# EAGLE design 131206_AriloRX_0_0 (EAGLE 6.4)
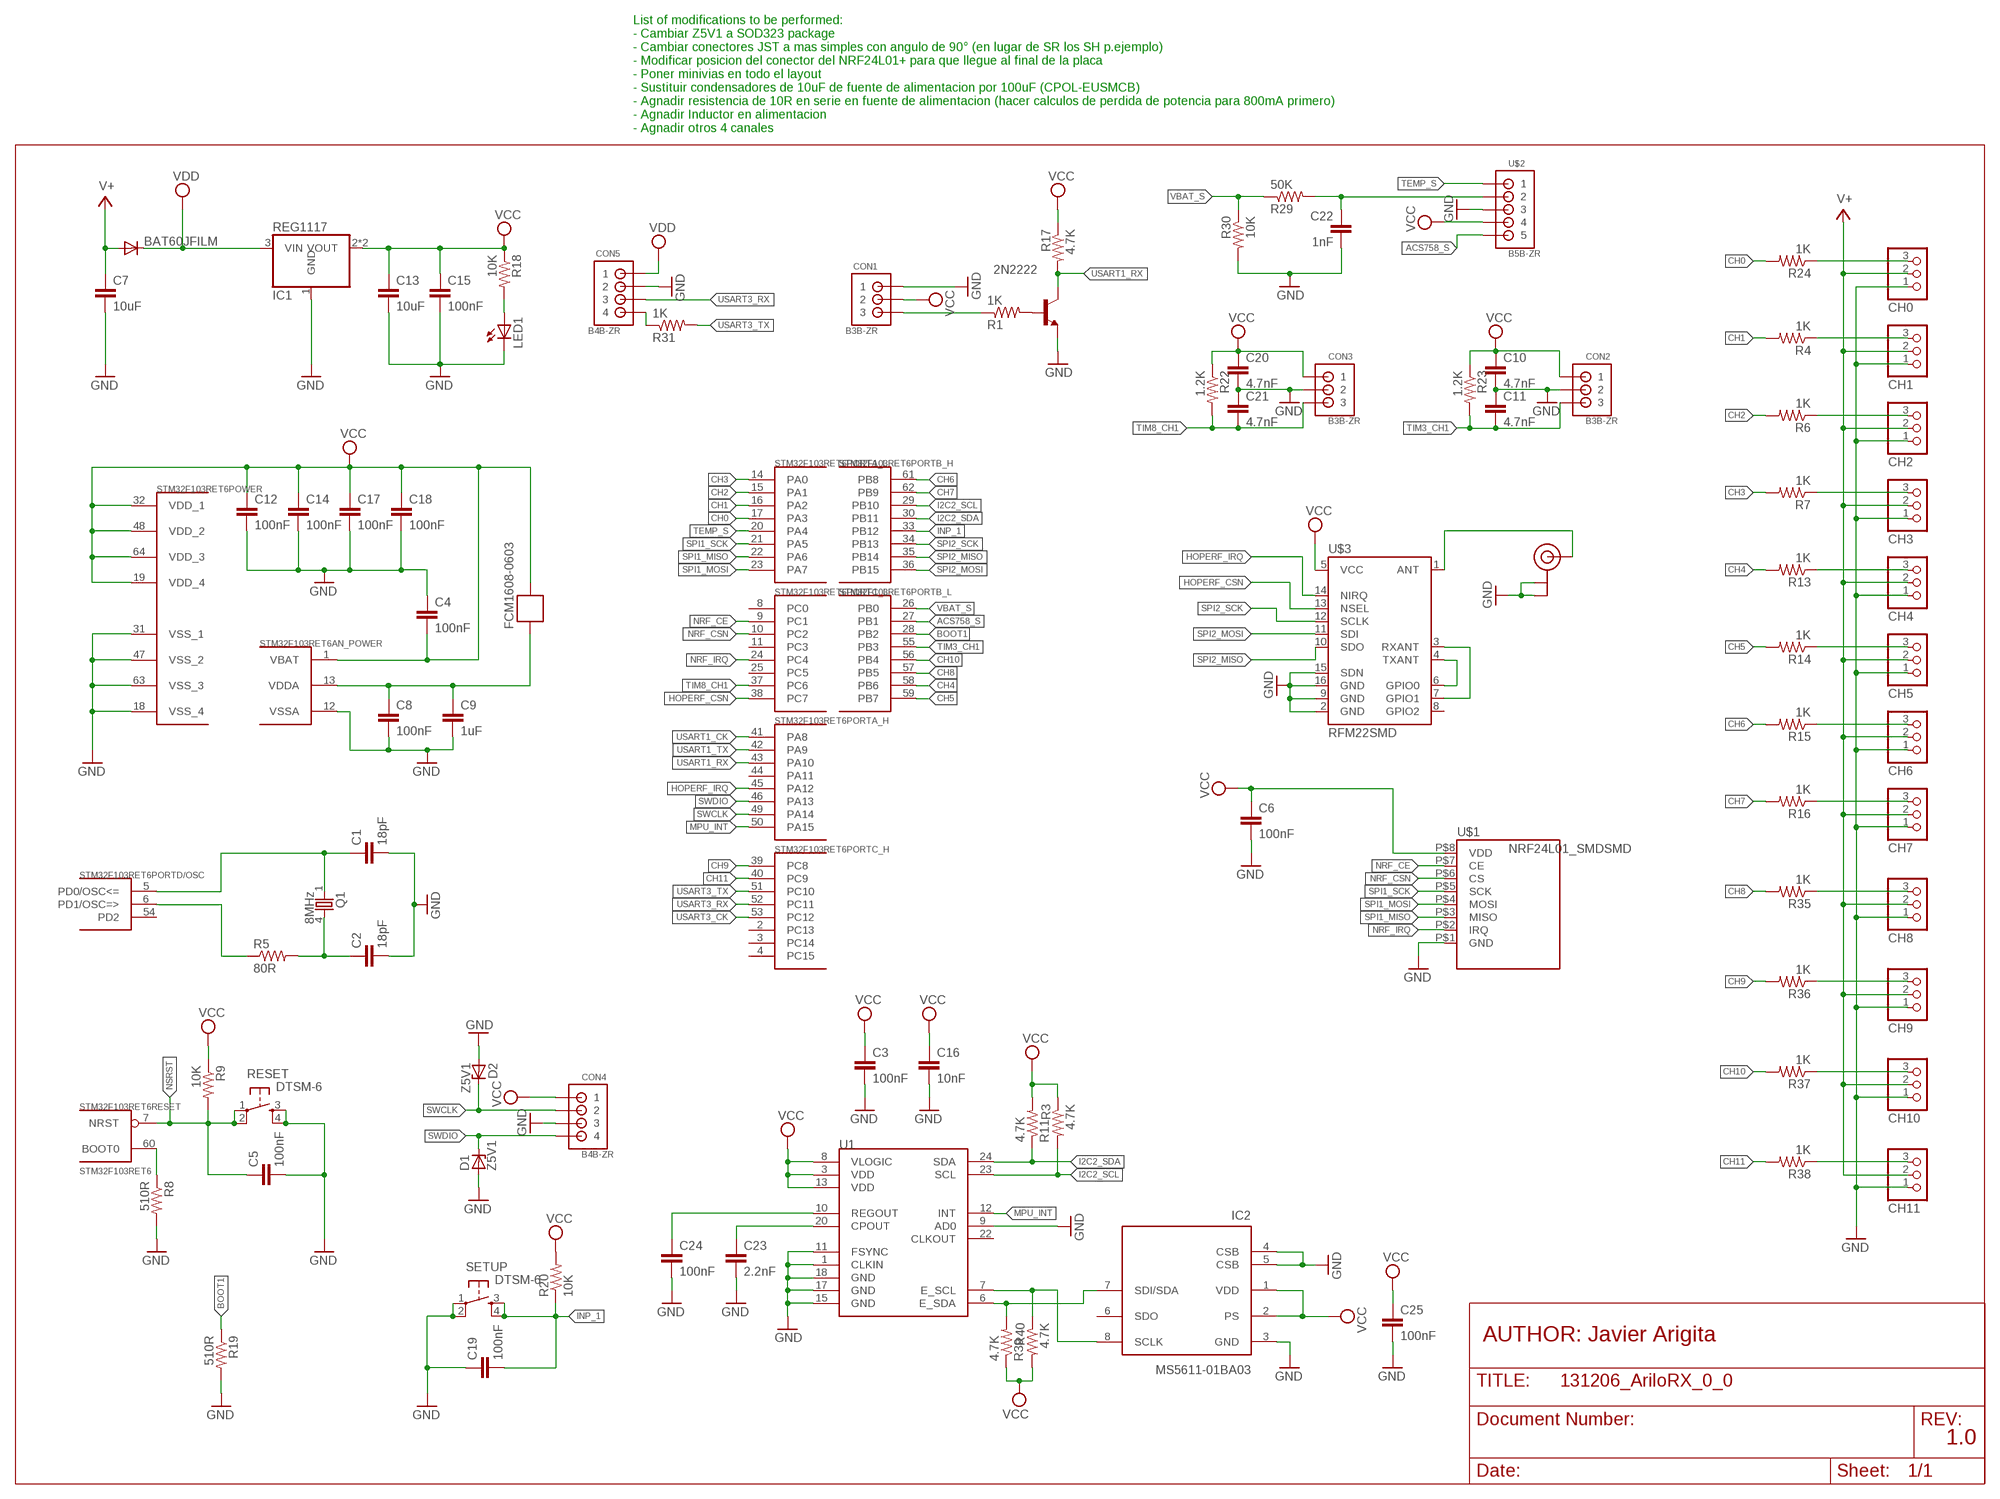
[diagram p0: schematic, sheet 1]

## Parts
2N2222  MMBT2222ALT1-NPN-SOT23-BEC  [SOT23-BEC]
BAT60JFILM  DIODE-SOD323-R  [SOD323-R]
C1  18pF  C-EUC0805  [C0805]
C2  18pF  C-EUC0805  [C0805]
C3  100nF  C-EUC0805  [C0805]
C4  100nF  C-EUC0805  [C0805]
C5  100nF  C-EUC0805  [C0805]
C6  100nF  C-EUC0805  [C0805]
C7  10uF  C-EUC3216  [C3216]
C8  100nF  C-EUC0805  [C0805]
C9  1uF  C-EUC3216  [C3216]
C10  4.7nF  C-EUC0805  [C0805]
C11  4.7nF  C-EUC0805  [C0805]
C12  100nF  C-EUC0805  [C0805]
C13  10uF  C-EUC3216  [C3216]
C14  100nF  C-EUC0805  [C0805]
C15  100nF  C-EUC0805  [C0805]
C16  10nF  C-EUC0805  [C0805]
C17  100nF  C-EUC0805  [C0805]
C18  100nF  C-EUC0805  [C0805]
C19  100nF  C-EUC0805  [C0805]
C20  4.7nF  C-EUC0805  [C0805]
C21  4.7nF  C-EUC0805  [C0805]
C22  1nF  C-EUC0805  [C0805]
C23  2.2nF  C-EUC0805  [C0805]
C24  100nF  C-EUC0805  [C0805]
C25  100nF  C-EUC0805  [C0805]
CH0  PINHD-1X3  [1X03]
CH1  PINHD-1X3  [1X03]
CH2  PINHD-1X3  [1X03]
CH3  PINHD-1X3  [1X03]
CH4  PINHD-1X3  [1X03]
CH5  PINHD-1X3  [1X03]
CH6  PINHD-1X3  [1X03]
CH7  PINHD-1X3  [1X03]
CH8  PINHD-1X3  [1X03]
CH9  PINHD-1X3  [1X03]
CH10  PINHD-1X3  [1X03]
CH11  PINHD-1X3  [1X03]
CON1  B3B-ZR  [B3B-ZR]
CON2  B3B-ZR  [B3B-ZR]
CON3  B3B-ZR  [B3B-ZR]
CON4  B4B-ZR  [B4B-ZR]
CON5  B4B-ZR  [B4B-ZR]
D1  Z5V1  ZENER-DIODESOD80C  [SOD80C]
D2  Z5V1  ZENER-DIODESOD80C  [SOD80C]
FCM1608-0603  FERRITE-BEAD  [R0603]
IC1  REG1117  [SOT223]
IC2  MS5611-01BA03  [SON125P300X500X100-8N]
LED1  LED0805  [CHIPLED_0805]
Q1  8MHz  MA506  [MA506]
R1  1K  RESISTOR0805  [R0805]
R3  4.7K  RESISTOR0805  [R0805]
R4  1K  RESISTOR0805  [R0805]
R5  80R  RESISTOR0805  [R0805]
R6  1K  RESISTOR0805  [R0805]
R7  1K  RESISTOR0805  [R0805]
R8  510R  RESISTOR0805  [R0805]
R9  10K  RESISTOR0805  [R0805]
R11  4.7K  RESISTOR0805  [R0805]
R13  1K  RESISTOR0805  [R0805]
R14  1K  RESISTOR0805  [R0805]
R15  1K  RESISTOR0805  [R0805]
R16  1K  RESISTOR0805  [R0805]
R17  4.7K  RESISTOR0805  [R0805]
R18  10K  RESISTOR0805  [R0805]
R19  510R  RESISTOR0805  [R0805]
R20  10K  RESISTOR0805  [R0805]
R22  1.2K  RESISTOR0805  [R0805]
R23  1.2K  RESISTOR0805  [R0805]
R24  1K  RESISTOR0805  [R0805]
R29  50K  RESISTOR0805  [R0805]
R30  10K  RESISTOR0805  [R0805]
R31  1K  RESISTOR0805  [R0805]
R35  1K  RESISTOR0805  [R0805]
R36  1K  RESISTOR0805  [R0805]
R37  1K  RESISTOR0805  [R0805]
R38  1K  RESISTOR0805  [R0805]
R39  4.7K  RESISTOR0805  [R0805]
R40  4.7K  RESISTOR0805  [R0805]
RESET  DTSM-6  [DTSM-6]
SETUP  DTSM-6  [DTSM-6]
STM32F103RET6  STM32F103RET6  STM32F10XRXT6  [TQFP64]
U1  MPU-9150QFN-24-NP  [QFN-24-NP]
U$1  NRF24L01_SMDSMD  [NRF24L01_SMD]
U$2  B5B-ZR  [B5B-ZR]
U$3  RFM22SMD  [RFM22-XXX-S2]
U$4  U.FL  [U.FL]

## Nets
ACS758_S: STM32F103RET6.27(PORTB_L:PB1) U$2.5
BOOT1: R19.1 STM32F103RET6.28(PORTB_L:PB2)
CH0: R24.2 STM32F103RET6.17(PORTA_L:PA3)
CH1: R4.2 STM32F103RET6.16(PORTA_L:PA2)
CH2: R6.2 STM32F103RET6.15(PORTA_L:PA1)
CH3: R7.2 STM32F103RET6.14(PORTA_L:PA0)
CH4: R13.2 STM32F103RET6.58(PORTB_L:PB6)
CH5: R14.2 STM32F103RET6.59(PORTB_L:PB7)
CH6: R15.2 STM32F103RET6.61(PORTB_H:PB8)
CH7: R16.2 STM32F103RET6.62(PORTB_H:PB9)
CH8: R35.2 STM32F103RET6.57(PORTB_L:PB5)
CH9: R36.2 STM32F103RET6.39(PORTC_H:PC8)
CH10: R37.2 STM32F103RET6.56(PORTB_L:PB4)
CH11: R38.2 STM32F103RET6.40(PORTC_H:PC9)
GND: 2N2222.E C1.2 C2.2 C3.2 C4.1 C5.2 C6.2 C7.2 C8.2 C9.2 C10.2 C11.1 C12.2 C13.2 C14.2 C15.2 C16.2 C17.2 C18.2 C19.1 C20.2 C21.1 C22.2 C23.2 C24.2 C25.2 CH0.1 CH1.1 CH2.1 CH3.1 CH4.1 CH5.1 CH6.1 CH7.1 CH8.1 CH9.1 CH10.1 CH11.1 CON1.1 CON2.2 CON3.2 CON4.3 CON5.2 D1.A D2.A IC1.1(GND) IC2.3(GND) IC2.4(CSB) IC2.5(CSB) LED1.C R8.2 R19.2 R30.2 RESET.3 RESET.4 SETUP.1 SETUP.2 STM32F103RET6.12(AN_POWER:VSSA) STM32F103RET6.18(POWER:VSS_4) STM32F103RET6.31(POWER:VSS_1) STM32F103RET6.47(POWER:VSS_2) STM32F103RET6.63(POWER:VSS_3) U1.1(CLKIN) U1.9(AD0) U1.11(FSYNC) U1.15(GND) U1.17(GND) U1.18(GND) U$1.P$1(GND) U$2.3 U$3.2(GND) U$3.9(GND) U$3.15(SDN) U$3.16(GND) U$4.P$1(GND) U$4.P$2(GND)
HOPERF_CSN: STM32F103RET6.38(PORTC_L:PC7) U$3.13(NSEL)
HOPERF_IRQ: STM32F103RET6.45(PORTA_H:PA12) U$3.14(NIRQ)
I2C2_SCL: R3.2 STM32F103RET6.29(PORTB_H:PB10) U1.23(SCL)
I2C2_SDA: R11.1 STM32F103RET6.30(PORTB_H:PB11) U1.24(SDA)
INP_1: C19.2 R20.1 SETUP.3 SETUP.4 STM32F103RET6.33(PORTB_H:PB12)
MPU_INT: STM32F103RET6.50(PORTA_H:PA15) U1.12(INT)
N$1: C1.1 Q1.1 STM32F103RET6.5(PORTD/OSC:PD0/OSC<=)
N$2: R5.1 STM32F103RET6.6(PORTD/OSC:PD1/OSC=>)
N$3: C2.1 Q1.4 R5.2
N$4: R8.1 STM32F103RET6.60(RESET:BOOT0)
N$5: U$3.3(RXANT) U$3.7(GPIO1)
N$6: U$3.4(TXANT) U$3.6(GPIO0)
N$7: U$3.1(ANT) U$4.P$3(SIGNAL)
N$9: CH0.3 R24.1
N$10: LED1.A R18.2
N$11: CON5.4 R31.1
N$13: CH8.3 R35.1
N$14: CON1.3 R1.1
N$15: C22.1 R29.2 U$2.2
N$16: 2N2222.B R1.2
N$17: C8.1 C9.1 FCM1608-0603.2 STM32F103RET6.13(AN_POWER:VDDA)
N$21: CH2.3 R6.1
N$23: CH4.3 R13.1
N$25: CH9.3 R36.1
N$26: CH10.3 R37.1
N$27: CH11.3 R38.1
N$28: IC2.8(SCLK) R40.1 U1.7(E_SCL)
N$29: IC2.7(SDI/SDA) R39.2 U1.6(E_SDA)
N$31: CH3.3 R7.1
N$32: CH6.3 R15.1
N$33: C23.1 U1.20(CPOUT)
N$34: CH5.3 R14.1
N$35: CH7.3 R16.1
N$40: C24.1 U1.10(REGOUT)
N$53: CH1.3 R4.1
NRF_CE: STM32F103RET6.9(PORTC_L:PC1) U$1.P$7(CE)
NRF_CSN: STM32F103RET6.10(PORTC_L:PC2) U$1.P$6(CS)
NRF_IRQ: STM32F103RET6.24(PORTC_L:PC4) U$1.P$2(IRQ)
NSRST: C5.1 R9.2 RESET.1 RESET.2 STM32F103RET6.7(RESET:NRST)
SPI1_MISO: STM32F103RET6.22(PORTA_L:PA6) U$1.P$3(MISO)
SPI1_MOSI: STM32F103RET6.23(PORTA_L:PA7) U$1.P$4(MOSI)
SPI1_SCK: STM32F103RET6.21(PORTA_L:PA5) U$1.P$5(SCK)
SPI2_MISO: STM32F103RET6.35(PORTB_H:PB14) U$3.10(SDO)
SPI2_MOSI: STM32F103RET6.36(PORTB_H:PB15) U$3.11(SDI)
SPI2_SCK: STM32F103RET6.34(PORTB_H:PB13) U$3.12(SCLK)
SWCLK: CON4.2 D2.C STM32F103RET6.49(PORTA_H:PA14)
SWDIO: CON4.4 D1.C STM32F103RET6.46(PORTA_H:PA13)
TEMP_S: STM32F103RET6.20(PORTA_L:PA4) U$2.1
TIM3_CH1: C11.2 CON2.3 R23.2 STM32F103RET6.55(PORTB_L:PB3)
TIM8_CH1: C21.2 CON3.3 R22.2 STM32F103RET6.37(PORTC_L:PC6)
USART1_CK: STM32F103RET6.41(PORTA_H:PA8)
USART1_RX: 2N2222.C R17.2 STM32F103RET6.43(PORTA_H:PA10)
USART1_TX: STM32F103RET6.42(PORTA_H:PA9)
USART3_CK: STM32F103RET6.53(PORTC_H:PC12)
USART3_RX: CON5.3 STM32F103RET6.52(PORTC_H:PC11)
USART3_TX: R31.2 STM32F103RET6.51(PORTC_H:PC10)
V+: BAT60JFILM.A C7.1 CH0.2 CH1.2 CH2.2 CH3.2 CH4.2 CH5.2 CH6.2 CH7.2 CH8.2 CH9.2 CH10.2 CH11.2
VBAT_S: R29.1 R30.1 STM32F103RET6.26(PORTB_L:PB0)
VCC: C3.1 C4.2 C6.1 C10.1 C12.1 C13.1 C14.1 C15.1 C16.1 C17.1 C18.1 C20.1 C25.1 CON1.2 CON2.1 CON3.1 CON4.1 FCM1608-0603.1 IC1.2(VOUT) IC1.4(VOUT) IC2.1(VDD) IC2.2(PS) R3.1 R9.1 R11.2 R17.1 R18.1 R20.2 R22.1 R23.1 R39.1 R40.2 STM32F103RET6.1(AN_POWER:VBAT) STM32F103RET6.19(POWER:VDD_4) STM32F103RET6.32(POWER:VDD_1) STM32F103RET6.48(POWER:VDD_2) STM32F103RET6.64(POWER:VDD_3) U1.3(VDD) U1.8(VLOGIC) U1.13(VDD) U$1.P$8(VDD) U$2.4 U$3.5(VCC)
VDD: BAT60JFILM.C CON5.1 IC1.3(VIN)
Unconnected: IC2.6(SDO) STM32F103RET6.2(PORTC_H:PC13) STM32F103RET6.3(PORTC_H:PC14) STM32F103RET6.4(PORTC_H:PC15) STM32F103RET6.8(PORTC_L:PC0) STM32F103RET6.11(PORTC_L:PC3) STM32F103RET6.25(PORTC_L:PC5) STM32F103RET6.44(PORTA_H:PA11) STM32F103RET6.54(PORTD/OSC:PD2) U1.22(CLKOUT) U$3.8(GPIO2)

## Notes on the sheet
- List of modifications to be performed:
  - Cambiar Z5V1 a SOD323 package
  - Cambiar conectores JST a mas simples con angulo de 90° (en lugar de SR los SH p.ejemplo)
  - Modificar posicion del conector del NRF24L01+ para que llegue al final de la placa
  - Poner minivias en todo el layout
  - Sustituir condensadores de 10uF de fuente de alimentacion por 100uF (CPOL-EUSMCB)
  - Agnadir resistencia de 10R en serie en fuente de alimentacion (hacer calculos de perdida de potencia para 800mA primero)
  - Agnadir Inductor en alimentacion
  - Agnadir otros 4 canales
- AUTHOR: Javier Arigita
- 1.0

## Library data of the parts
2N2222 = transistor:*-NPN-: NPN Transistror BF959 corrected 2008.03.06
BAT60JFILM = diode:DIODE-: DIODE
C1-C6 C8 C10-C12 C14-C25 = rcl:C-EU: CAPACITOR, European symbol
C7 C9 C13 = resistor:C-EU: CAPACITOR, European symbol
CH0 CH1-CH11 = pinhead_rc:PINHD-1X3: PIN HEADER
CON1-CON3 = jst:B3B-ZR: JST-ZH Connector 3 pol, 1.5mm pitch Package: B3B-ZR Source: http://www.jst-mfg.com/product/pdf/eng/eZH.pdf
CON4 CON5 = jst:B4B-ZR: JST-ZH Connector 4 pol, 1.5mm pitch Package: B4B-ZR Source: http://www.jst-mfg.com/product/pdf/eng/eZH.pdf
D1 D2 = diode:ZENER-DIODE: Z-Diode
FCM1608-0603 = BaseApp:FERRITE-BEAD
IC1 = CEDT:REG1117: 800mA and 1A Low Dropout (LDO) Positive Regulator 1.8V, 2.5V, 2.85V, 3.3V, 5V, and Adj
IC2 = Measurement-Specialties:MS5611-01BA03: Variometer Module, with stainless steel cap
LED1 = CEDT:LED
Q1 = crystal-epson:MA506
R1 R3-R9 R11 R13-R20 R22-R24 R29-R31 R35-R40 = CEDT:RESISTOR
RESET SETUP = switch-tact:DTSM-6
STM32F103RET6 = stm32:STM32F10XRXT6: STM32F101/103 64pin LQFP
U1 = SparkFun-Sensors:MPU-9150: 9DOF (3mag, 3accel, 3rotat). I2C interface.
U$1 = NRF24L01+:NRF24L01_SMD
U$2 = jst:B5B-ZR: JST-ZH Connector 5 pol, 1.5mm pitch Package: B5B-ZR Source: http://www.jst-mfg.com/product/pdf/eng/eZH.pdf
U$3 = SparkFun-RF:RFM22: The RFM22 is a low-power, low cost radio that is capable of operating in the 434MHz and 900MHz open bands. It's frequency is software defined and there are some very good libraries written for it.
U$4 = SparkFun-Connectors:U.FL: SMD antenna connector- WRL-09144

## Board
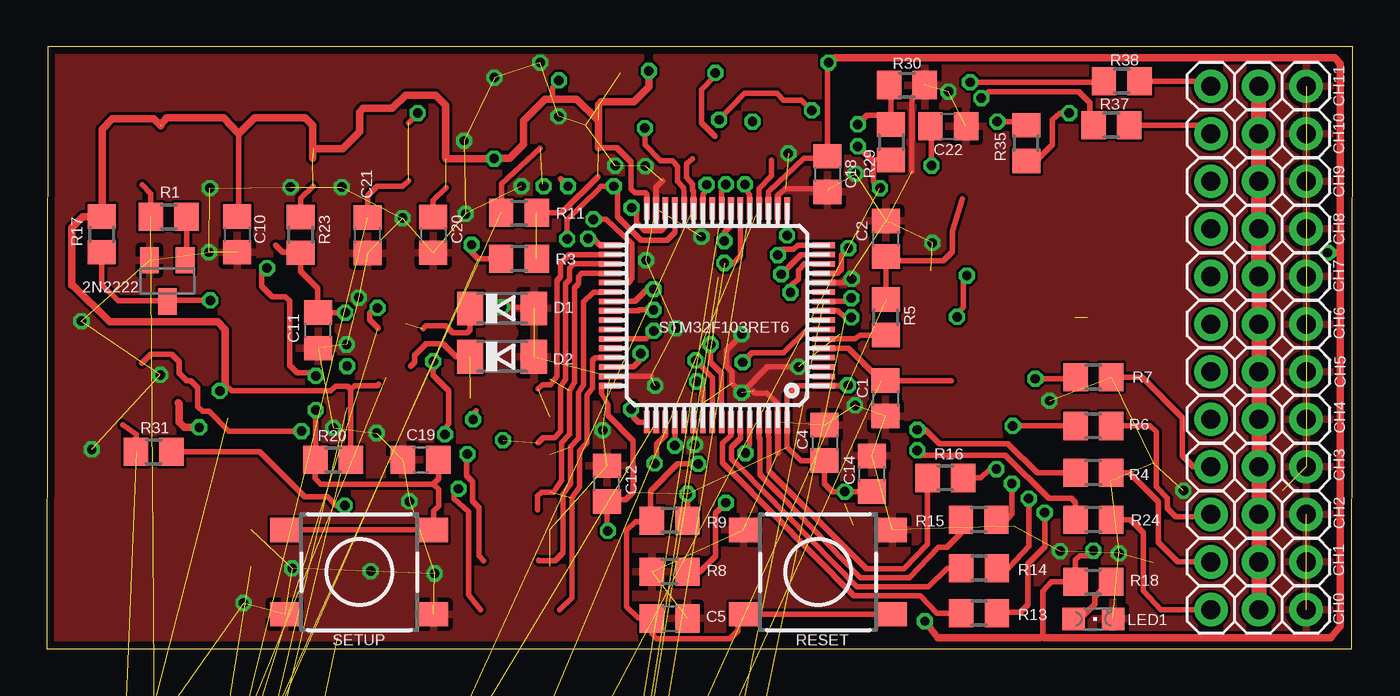
[diagram p1: board, top side]
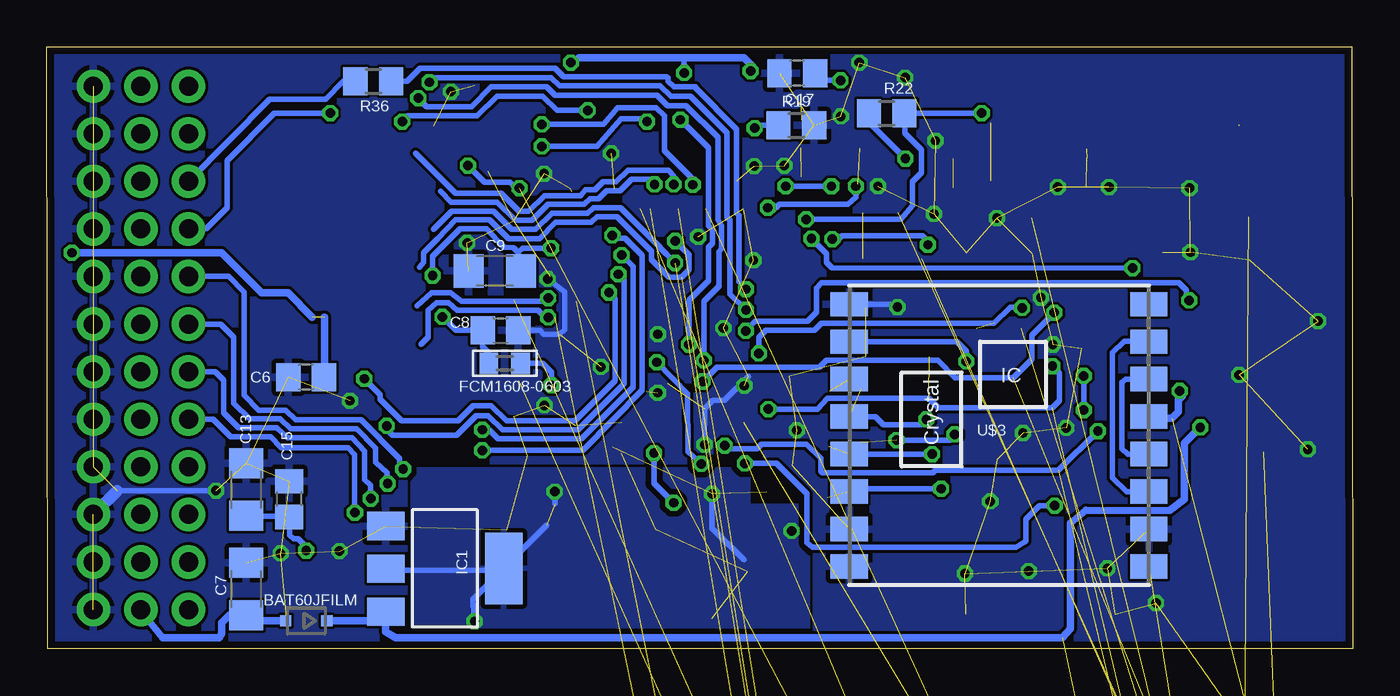
[diagram p2: board, bottom side, seen from below]

Size 69.73 x 32.14 mm. Coordinates in mm from the lower left corner, seen from the top.
Outline: 0,0 69.69,0 69.73,32.14 0.05,32.14 0,0
Copper layers (1*16): Top 0.0356mm / dielectric 1.5011mm / Bottom 0.0356mm
Design rules "default": minimum track width 6mil, minimum drill 13mil, track to track 6mil, track to pad 6mil, pad to pad 6mil, via to via 6mil, smd to smd 6mil, copper to edge 15mil, drill to drill 6mil, minimum pad ring 7mil, minimum via ring 7mil, stop-mask expansion 4mil, vias tented up to drill 0mil, thermal gap 10mil

### Footprints (pad centres in the part's own frame; a part is rotated, then mirrored left to right if it is on the bottom)
SOT23-BEC = smd 1 x 1.4: B -0.95,-1.1; C 0,1.1; E 0.95,-1.1
SOD323-R = smd 0.6 x 0.6: A 1.1,0; C -1.1,0
C0805 = smd 1.3 x 1.5: 1 -0.95,0; 2 0.95,0
C3216 = smd 1.6 x 1.8: 1 -1.4,0; 2 1.4,0
1X03 = drill 1.016 pad 1.778: 1 -2.54,0; 2 0,0; 3 2.54,0
B3B-ZR = drill 0.7 pad 1.1: 1 -1.5,0; 2 0,0; 3 1.5,0
B4B-ZR = drill 0.7: 1 6,-1.3; 2 4.5,-1.3; 3 3,-1.3; 4 1.5,-1.3
SOD80C = smd 1.4 x 1.8: A 1.7,0; C -1.7,0
R0603 = smd 1 x 1.1: 1 -0.85,0; 2 0.85,0
SOT223 = smd 1.499 x 2.007: 1 -2.261,-3.15; 2 0.025,-3.15; 3 2.311,-3.15 | smd 3.81 x 2.007: 4 0,3.15
SON125P300X500X100-8N = smd 1.35 x 0.55: 1 -1.2,1.875; 2 -1.2,0.625; 3 -1.2,-0.625; 4 -1.2,-1.875; 5 1.2,-1.875; 6 1.2,-0.625; 7 1.2,0.625; 8 1.2,1.875
CHIPLED_0805 = smd 1.2 x 1.2: A 0,-1.05; C 0,1.05
MA506 = smd 4.064 x 2.032: 1 -5.461,-1.778; 2 5.588,-1.778; 3 5.588,1.778; 4 -5.461,1.778
R0805 = smd 1.3 x 1.5: 1 -0.95,0; 2 0.95,0
DTSM-6 = smd 1.55 x 1.3: 1 -3.975,2.25; 2 3.975,2.25; 3 -3.975,-2.25; 4 3.975,-2.25
TQFP64 = smd 1.2 x 0.3: 1 -5.7,3.75; 2 -5.7,3.25; 3 -5.7,2.75; 4 -5.7,2.25; 5 -5.7,1.75; 6 -5.7,1.25; 7 -5.7,0.75; 8 -5.7,0.25; 9 -5.7,-0.25; 10 -5.7,-0.75; 11 -5.7,-1.25; 12 -5.7,-1.75; 13 -5.7,-2.25; 14 -5.7,-2.75; 15 -5.7,-3.25; 16 -5.7,-3.75; 33 5.7,-3.75; 34 5.7,-3.25; 35 5.7,-2.75; 36 5.7,-2.25; 37 5.7,-1.75; 38 5.7,-1.25; 39 5.7,-0.75; 40 5.7,-0.25; 41 5.7,0.25; 42 5.7,0.75; 43 5.7,1.25; 44 5.7,1.75; 45 5.7,2.25; 46 5.7,2.75; 47 5.7,3.25; 48 5.7,3.75 | smd 0.3 x 1.2: 17 -3.75,-5.7; 18 -3.25,-5.7; 19 -2.75,-5.7; 20 -2.25,-5.7; 21 -1.75,-5.7; 22 -1.25,-5.7; 23 -0.75,-5.7; 24 -0.25,-5.7; 25 0.25,-5.7; 26 0.75,-5.7; 27 1.25,-5.7; 28 1.75,-5.7; 29 2.25,-5.7; 30 2.75,-5.7; 31 3.25,-5.7; 32 3.75,-5.7; 49 3.75,5.7; 50 3.25,5.7; 51 2.75,5.7; 52 2.25,5.7; 53 1.75,5.7; 54 1.25,5.7; 55 0.75,5.7; 56 0.25,5.7; 57 -0.25,5.7; 58 -0.75,5.7; 59 -1.25,5.7; 60 -1.75,5.7; 61 -2.25,5.7; 62 -2.75,5.7; 63 -3.25,5.7; 64 -3.75,5.7
QFN-24-NP = smd 0.8 x 0.3: 1 -2,1.25; 2 -2,0.75; 3 -2,0.25; 4 -2,-0.25; 5 -2,-0.75; 6 -2,-1.25; 13 2,-1.25; 14 2,-0.75; 15 2,-0.25; 16 2,0.25; 17 2,0.75; 18 2,1.25 | smd 0.3 x 0.8: 7 -1.25,-2; 8 -0.75,-2; 9 -0.25,-2; 10 0.25,-2; 11 0.75,-2; 12 1.25,-2; 19 1.25,2; 20 0.75,2; 21 0.25,2; 22 -0.25,2; 23 -0.75,2; 24 -1.25,2
NRF24L01_SMD = smd 1.27 x 0.635: P$1 26.807,10.492; P$2 26.807,9.222; P$3 26.807,7.952; P$4 26.807,6.682; P$5 26.807,5.412; P$6 26.807,4.142; P$7 26.807,2.872; P$8 26.807,1.602
B5B-ZR = drill 0.7: 1 7.5,-1.3; 2 6,-1.3; 3 4.5,-1.3; 4 3,-1.3; 5 1.5,-1.3
RFM22-XXX-S2 = smd 2 x 1.3: 1 -8,7; 2 -8,5; 3 -8,3; 4 -8,1; 5 -8,-1; 6 -8,-3; 7 -8,-5; 8 -8,-7; 9 8,-7; 10 8,-5; 11 8,-3; 12 8,-1; 13 8,1; 14 8,3; 15 8,5; 16 8,7
U.FL = smd 2.2 x 0.85: P$1 0,1.375; P$2 0,-1.375 | smd 1.05 x 1: P$3 1.525,0; P$4 -1.525,0

### Placement (x,y rotation side)
2N2222  6.43,19.65 180 top
BAT60JFILM  55.88,1.5 180 bottom
C1  44.78,13.38 270 top
C2  44.81,21.9 90 top
C3  -5.8,-53.55 0 top  (outside the outline)
C4  41.53,11 270 top
C5  33.26,1.62 0 top
C6  55.88,14.5 180 bottom
C7  59.09,3.2 90 bottom
C8  45.51,17 0 bottom
C9  45.81,20.18 180 bottom
C10  10.16,22.12 270 top
C11  14.48,17 90 top
C12  29.91,8.82 90 top
C13  59.09,8.5 90 bottom
C14  44.06,9.35 90 top
C15  56.78,8 90 bottom
C16  -5.8,-59.6 0 top  (outside the outline)
C17  29.66,30.73 180 bottom
C18  41.69,25.35 270 top
C19  19.96,10.1 0 top
C20  20.64,22.1 270 top
C21  17.14,22.07 90 top
C22  48.13,27.9 0 top
C23  -10.6,-77.75 0 top  (outside the outline)
C24  -10.6,-83.8 0 top  (outside the outline)
C25  -10.6,-89.85 0 top  (outside the outline)
CH0  64.71,2.1 180 top
CH1  64.71,4.64 180 top
CH2  64.71,7.18 180 top
CH3  64.71,9.72 180 top
CH4  64.71,12.26 180 top
CH5  64.71,14.8 180 top
CH6  64.71,17.34 180 top
CH7  64.71,19.88 180 top
CH8  64.71,22.42 180 top
CH9  64.71,24.96 180 top
CH10  64.71,27.5 180 top
CH11  64.71,30.04 180 top
CON1  4.3,-8.5 0 top  (outside the outline)
CON2  4.3,-15.75 0 top  (outside the outline)
CON3  4.3,-23 0 top  (outside the outline)
CON4  1.3,-29 0 top  (outside the outline)
CON5  1.3,-36.85 0 top  (outside the outline)
D1  24.31,18.18 0 top
D2  24.31,15.6 0 top
FCM1608-0603  45.28,15.25 180 bottom
IC1  48.48,4.3 270 bottom
IC2  -10,-59.85 0 top  (outside the outline)
LED1  55.88,1.6 270 top
Q1  -4.25,-104.25 0 top  (outside the outline)
R1  6.51,23.07 0 top
R3  25.21,20.82 180 top
R4  55.88,9.4 180 top
R5  44.81,17.7 90 top
R6  55.88,11.9 180 top
R7  55.88,14.5 180 top
R8  33.26,4.12 180 top
R9  33.26,6.85 180 top
R11  25.21,23.27 0 top
R13  49.78,1.9 180 top
R14  49.78,4.3 180 top
R15  49.76,6.9 180 top
R16  47.98,9.12 180 top
R17  2.94,22.12 270 top
R18  55.88,3.58 0 top
R19  29.71,27.95 0 bottom
R20  15.29,10.1 0 top
R22  24.89,28.6 0 bottom
R23  13.56,22.1 270 top
R24  55.88,6.9 180 top
R29  45.09,27.05 270 top
R30  45.94,30.1 0 top
R31  5.71,10.53 0 top
R35  52.3,27 90 top
R36  52.3,30.3 0 bottom
R37  56.85,27.95 180 top
R38  57.4,30.3 180 top
R39  -10.6,-65.65 0 top  (outside the outline)
R40  -10.6,-71.7 0 top  (outside the outline)
RESET  41.19,4.1 180 top
SETUP  16.68,4.1 180 top
STM32F103RET6  35.78,17.8 180 top
U1  -4.85,-45.9 0 top  (outside the outline)
U$1  -12.45,-121.35 0 top  (outside the outline)
U$2  1.3,-44.7 0 top  (outside the outline)
U$3  18.89,11.4 180 bottom
U$4  -11.3,-124.45 0 top  (outside the outline)

### Tracks (layer width: path | path; a pad name or v marks a point on that pad's centre or on a via)
ACS758_S  (1 unrouted)
  Top 0.305: 34.48,26.18 34.16,25.9 34.16,25.18 34.48,24.8 34.48,24.48 34.53,24.43 STM32F103RET6.27
BOOT1  (via drill 0.5)
  Top 0.305: v31.93,27.8 31.93,26.9 32.78,26.05 33.41,26.05 33.69,25.77 33.69,24.98 34.01,24.62 34.03,24.35 STM32F103RET6.28
  Bottom 0.305: R19.1 31.76,27.95 v31.93,27.8
CH0  (via drill 0.5 pad 0.25)
  Top 0.305: R24.2 54.94,7.83 54.71,8.05 53.51,8.05 51.19,10.35 46.76,10.35 v46.48,10.6 | v39.53,22.07 STM32F103RET6.17 39.53,23.57
  Bottom 0.305: v46.48,10.6 41.11,10.6 37.96,13.8 37.96,21.02 38.86,21.93 39.34,21.93 v39.53,22.07
CH1  (via drill 0.5 pad 0.25)
  Top 0.305: R4.2 52.88,9.4 51.34,10.95 47.66,10.95 46.91,11.7 v46.48,11.7 | v39.03,21.02 39.03,21.07 39.28,21.32 39.88,21.32 40.11,21.55 STM32F103RET6.16
  Bottom 0.305: v46.48,11.7 46.11,11.7 45.63,11.22 41.19,11.22 38.44,13.97 38.44,20.43 v39.03,21.02
CH2  (via drill 0.5 pad 0.25)
  Top 0.305: R6.2 v51.59,11.9 | v39.21,20 39.23,20 40.28,21.05 STM32F103RET6.15
  Bottom 0.305: v51.59,11.9 51.59,11.72 51.26,11.4 47.86,11.4 46.81,12.45 46.16,12.45 45.38,11.7 41.36,11.7 38.91,14.15 38.91,19.7 v39.21,20
CH3  (via drill 0.5, 0.5 pad 0.25)
  Top 0.305: STM32F103RET6.14 40.46,20.55 40.13,20.23 40.13,19.73 39.71,19.38 v39.71,19.02 | v52.78,14.43 54.88,14.43 54.98,14.53 54.96,14.53 R7.2
  Bottom 0.305: v39.71,19.02 39.38,18.7 39.38,14.32 41.53,12.18 45.19,12.18 46.01,12.97 46.96,12.97 47.76,12.18 50.78,12.18 51.94,13.32 51.94,13.57 v52.78,14.43
CH4
  Top 0.305: R13.2 47.53,1.9 46.66,2.83 43.11,2.83 36.53,9.47 36.09,9.93 36.09,10.97 36.53,11.4 STM32F103RET6.58
CH5
  Top 0.305: R14.2 48.09,4.3 47.09,3.33 43.26,3.33 37.03,9.68 36.56,10.12 36.56,10.78 37.03,11.25 STM32F103RET6.59 37.03,12.15
CH6
  Top 0.305: R15.2 48.81,6.17 48.06,5.42 47.61,5.42 46.06,3.8 43.46,3.8 39.26,8.12 38.09,9.3 38.09,11.22 38.03,11.28 STM32F103RET6.61
CH7
  Top 0.305: STM32F103RET6.62 38.53,11.35 38.56,11.3 38.56,9.47 43.76,4.28 45.76,4.28 47.03,5.6 R16.2 47.03,9.18
CH8  (via drill 0.5)
  Top 0.305: R35.2 52.1,28.15 v50.75,28.15 | v40.85,28.75 40.3,29.3 39.35,29.3 39,29.65 37.25,29.65 v35.9,28.25 | STM32F103RET6.57 36.03,14.71 35.45,15.3 v35.45,16.25
  Bottom 0.305: v50.75,28.15 50.45,28.45 46.75,28.45 45.7,29.5 43.25,29.5 42.5,28.75 v40.85,28.75 | v35.9,28.25 34.4,26.75 34.4,22.6 34.2,22.4 34.2,21.65 34.4,21.45 34.4,19.65 35.45,18.6 v35.45,16.25
CH9  (via drill 0.5)
  Top 0.305: v32.4,19.2 32.05,19.2 31.4,18.55 STM32F103RET6.39
  Bottom 0.305: R36.2 50.5,30.3 49.8,31 42.6,31 42.15,30.55 36.65,30.55 36.55,30.5 36.55,30.3 36.25,30 35.1,30 35.1,29.95 32.9,27.75 32.9,23.25 32.77,23.14 32.77,19.59 v32.4,19.2
CH10  (via drill 0.5)
  Top 0.305: R37.2 55.7,28.15 55.7,29.15 55.1,29.75 50.3,29.75 49.95,29.4 v49.9,29.4 | v34.65,15.4 35.53,14.48 STM32F103RET6.56
  Bottom 0.305: v49.9,29.4 49.45,28.95 47.05,28.95 46,30 43.05,30 42.6,29.55 37.15,29.55 36.6,29 35.6,29 33.9,27.3 33.9,22.9 33.7,22.6 33.7,21.35 33.85,21.2 33.85,19.35 34.65,18.55 v34.65,15.4
CH11  (via drill 0.5)
  Top 0.305: R38.2 56.4,30.25 v49.3,30.25 | v32.4,18.1 31.65,18.1 31.6,18.05 STM32F103RET6.40
  Bottom 0.305: v49.3,30.25 49.05,30.5 42.8,30.5 42.35,30.05 37,30.05 36.4,29.5 35.35,29.5 33.4,27.55 33.4,23.05 33.24,22.89 33.24,18.94 v32.4,18.1
GND  (via drill 0.5, 0.5 pad 0.25)  (114 unrouted)
  Top 0.305: 37.71,13.75 37.81,13.65 38.46,13.65 39.03,13.07 STM32F103RET6.63 39.03,10.45 | STM32F103RET6.12 42.5,19.55 | 42.5,19.55 42.59,19.55 v42.98,19.75 42.85,19.9 42.5,19.55 | 41.76,24.57 39.44,24.57 39.03,24.23 STM32F103RET6.18 | STM32F103RET6.47 32.26,14.55 | STM32F103RET6.31 32.53,24.65 32.88,25 | v24.31,18.25 25.96,18.25 26.04,18.18 | R30.2 46.2,29.41 46.2,25.5 | v40.15,15.05 38.48,15.05 v37.11,13.68 36.6,14.19 36.6,14.8 36.3,15.1 36.3,15.95 37.1,16.75 v37.1,16.8
  Bottom 0.305: v34.61,10.9 34.61,12.82 34.16,13.28 33.53,13.28 32.26,14.55 | U$3.9 24.46,18.4 v24.31,18.25 | C8.2 43.4,17 43.2,16.8 42.35,16.8 42.1,17.05 42.1,19.07 v42.98,19.75 | v60.7,8.45 65.98,8.45
  Bottom 0.61: 65.98,8.45 CH2.1
  other vias: 43.16,13 47.28,21.68 54.11,5.22 33.61,17.12 13.01,24.65 22.29,27.12 43.19,25.38 57.26,5.1 22.36,23.23 16.01,16.25 17.61,11.53 27.34,28.43 31.96,25.77 32.48,14.05 6.06,14.62 8.71,24.6 29.68,11.68 19.36,7.88 20.71,4.03 8.66,21.18 26.35,31.3 34.95,22 48.15,29.75 30.35,25.8 25.35,24.7 39.6,26.45 23.9,30.5 16.65,18.75 1.85,17.5 15.75,24.65 19,23 15.3,11.8 10.5,2.45 13.1,4.3 2.4,10.65 17.3,4.15 32,20.75 53.55,13.25
  pour Bottom (rank 2): 0.48,31.64 69.19,31.64 69.19,0.5 0.48,0.5
  pour Top: 0.48,31.64 69.19,31.64 69.19,0.5 0.48,0.5
HOPERF_CSN  (via drill 0.5)  (1 unrouted)
  Top 0.305: STM32F103RET6.38 29.18,19.05 28.66,18.52 28.66,14.1 28.39,13.68 28.39,11.25 27.96,10.8 27.96,8.82 27.56,8.25 27.56,5.12 27.14,4.7 26.29,4.7 26.26,4.72 | v22.46,10.4 22.41,10.35 22.41,9.25 22.73,8.93 22.73,7.88 23.09,7.53 23.09,4.97 23.34,4.7
  Bottom 0.305: v22.46,10.4 U$3.13
HOPERF_IRQ  (via drill 0.5)  (1 unrouted)
  Top 0.305: STM32F103RET6.45 29.31,15.55 29.29,15.53 29.26,15.53 29.14,15.4 29.14,13.95 28.86,13.55 28.86,11 28.43,10.57 28.43,8.65 28.04,8.07 28.04,2.73 27.39,2.1 | 23.16,2.1 22.54,2.9 22.54,7.33 21.76,8.03 21.76,8.35 v21.98,8.55
  Bottom 0.305: v21.98,8.55 26.73,8.55 U$3.14
I2C2_SCL  (via drill 0.5)  (1 unrouted)
  Top 0.305: 27.43,25.1 v27.84,24.7 | STM32F103RET6.29 33.53,22.25 33.11,21.82 31.73,21.82 30.48,23.07 30.48,24.5 v30.29,24.7 29.6,24.7 29.45,24.55 27.79,22.9 v27.79,21.88 | R3.2 23.04,20.82 22.68,21.18 v22.68,21.57
  Bottom 0.305: v27.84,24.7 v30.29,24.7 | v22.68,21.57 22.68,21.75 22.98,22.05 27.29,22.05 27.46,21.88 v27.79,21.88
I2C2_SDA  (via drill 0.5)  (2 unrouted)
  Top 0.305: 26.34,26.73 24.29,24.82 24.29,23.43 24.26,23.4 R11.1 | 26.43,24.8 v26.54,24.7 | v31.23,23.55 31.48,23.32 31.48,22.77 31.91,22.32 32.81,22.32 33.03,22.55 STM32F103RET6.30
  Bottom 0.305: v26.54,24.7 26.54,24.1 26.96,23.75 30.6,23.75 30.8,23.55 v31.23,23.55
INP_1  (via drill 0.5)
  Top 0.305: 14.29,10.1 14.31,10.07 14.34,10.07 | R20.1 14.34,10.07 | 14.34,10.07 14.34,9.1 14.63,8.8 20.64,8.8 | 20.64,8.8 20.91,9.07 C19.2 | SETUP.4 SETUP.3 20.66,7.38 20.91,7.62 20.91,8.53 20.64,8.8 | v11.76,20.32 11.48,20.05 11.48,19.35 12.04,18.8 12.73,18.8 12.96,18.57 12.96,15.15 13.36,14.75 14.16,14.75 v14.36,14.57 | v14.36,12.75 14.36,10.1 14.34,10.07 | v28.9,21.9 29.2,21.9 29.55,21.55 STM32F103RET6.33
  Bottom 0.305: v11.76,20.32 27.81,20.35 28.1,20.64 28.1,21.1 v28.9,21.9 | v14.36,14.57 v14.36,12.75
MPU_INT  (1 unrouted)
N$1  (1 unrouted)
  Top 0.305: 48.31,14.32 C1.1 44.53,14.32 42.81,16.05 STM32F103RET6.5
N$2
  Top 0.305: R5.1 43.41,16.75 43.16,16.55 STM32F103RET6.6
N$3  (1 unrouted)
  Top 0.305: R5.2 C2.1 45.03,20.73 47.88,20.73 48.36,21.2 48.36,22.3 48.88,24.03
N$4  (via drill 0.5)
  Top 0.305: STM32F103RET6.60 37.53,10.9 37.31,10.65 v37.31,10.45 | R8.1 34.88,4.12 35.71,4.95 35.71,7.25 v36.26,7.8
  Bottom 0.305: v37.31,10.45 37.31,8.85 v36.26,7.8
N$5
  Bottom 0.305: U$3.3 12.06,8.4 12.84,9.15 12.84,15.8 12.19,16.43 10.91,16.43 U$3.7
N$6
  Bottom 0.305: U$3.6 12.11,14.4 12.34,14.22 12.34,10.68 12.01,10.4 U$3.4
N$7  (1 unrouted)
N$9
  Top 0.305: R24.1 57.85,6.9 58.55,6.2 58.55,3.1 59.5,2.1 CH0.3
N$10
  Top 0.305: LED1.A 55.19,1.6 55.96,2.38 55.96,2.77 56.76,3.58 R18.2
N$11  (1 unrouted)
  Top 0.305: R31.1 4.76,11.45 4.06,11.97
N$13  (via drill 0.5)
  Top 0.305: v54.6,28.6 54.1,28.6 53.7,28.25 53.7,26.9 52.85,26.05 R35.1
  Bottom 0.305: CH8.3 61.23,22.42 60.1,23.55 60.1,26.05 57.6,28.6 v54.6,28.6
N$14  (1 unrouted)
  Top 0.305: R1.1 5.56,24.3 5.08,24.77
N$15  (via drill 0.5)  (1 unrouted)
  Top 0.305: C22.1 47.2,27.66 47.25,27.61 v47.25,25.8 | v43.31,26.82 44.03,26.1 44.15,26.1 | 44.15,26.1 R29.2 | v44.5,24.6 44.15,24.95 44.15,26.1
  Bottom 0.305: v43.31,26.82 40.36,26.82 39.06,28.3 37.84,28.3 v37.69,28.15 | v47.25,25.8 46.35,24.9 45,24.9 44.7,24.6 v44.5,24.6
N$16
  Top 0.305: R1.2 7.46,20.82 2N2222.B
N$17  (via drill 0.5 pad 0.25)
  Top 0.305: v48.61,17.73 48.61,17.93 48.94,18.25 48.94,19.73 v49.13,19.93 | STM32F103RET6.13 42.21,20.05 42.44,20.27 42.44,21.02 v42.81,21.4
  Bottom 0.305: FCM1608-0603.2 46.13,15.8 46.46,16.12 C8.1 47.88,17 v48.61,17.73 | v49.13,19.93 49.13,20.95 47.66,22.43 46.26,22.43 45.34,21.45 45.26,21.45 44.81,21.43 44.56,21.18 | 44.56,21.18 C9.1 44.26,19.95 44.23,19.93 43.76,19.93 | v42.81,21.4 44.34,21.4 44.56,21.18
N$21
  Top 0.305: R6.1 58.9,11.9 59.25,11.6 59.25,8.65 59.85,8.05 59.85,7.5 60.3,7.05 62.04,7.05 CH2.3
N$23  (via drill 0.5 pad 0.25)
  Top 0.152: 50.97,2.54 R13.1
  Top 0.305: R13.1 50.81,1.98 50.84,1.95 51.98,1.95 52.38,2.35 52.38,4.55 53.28,5.45 v53.28,7.28
  Bottom 0.305: v53.28,7.28 53.28,10.38 53.63,10.75 57.21,10.75 57.78,11.32 59.92,11.32 60.86,12.26 CH4.3
N$25
  Bottom 0.305: CH9.3 57.83,29.35 54.85,29.35 53.9,30.3 R36.1
N$26
  Top 0.305: CH10.3 61.67,27.95 R37.1
N$27
  Top 0.305: CH11.3 61.91,30.3 R38.1
N$28  (2 unrouted)
N$29  (2 unrouted)
N$31
  Top 0.305: R7.1 58.5,14.5 60.65,12.35 60.65,10.3 61.23,9.72 CH3.3
N$32  (via drill 0.5 pad 0.25)
  Top 0.305: v51.53,8.82 51.53,7.17 51.28,6.92 R15.1
  Bottom 0.305: v51.53,8.82 51.56,9.4 52.19,9.97 52.19,10.7 53.19,11.75 56.71,11.75 57.28,12.28 58.91,12.28 59.75,13.12 59.75,16.65 60.44,17.34 CH6.3
N$33  (1 unrouted)
N$34  (via drill 0.5 pad 0.25)
  Top 0.305: R14.1 51.36,4.3 51.38,4.33 52.44,5.47 v52.44,8.03
  Bottom 0.305: v52.44,8.03 52.44,8.72 52.76,9.03 52.76,10.55 53.44,11.28 56.88,11.28 57.46,11.8 59.5,11.8 60.3,12.6 60.3,14.35 60.75,14.8 CH5.3
N$35  (via drill 0.5 pad 0.25)
  Top 0.305: v50.71,9.6 50.36,9.6 49.88,9.15 48.96,9.15 | 48.96,9.15 48.94,9.18 | R16.1 48.96,9.15
  Bottom 0.305: v50.71,9.6 50.88,9.78 50.88,10.15 52.96,12.22 56.44,12.22 56.98,12.75 58.41,12.75 59.2,13.54 59.2,19.05 60.03,19.88 CH7.3
N$40  (1 unrouted)
N$53
  Top 0.305: R4.1 57.8,9.4 59.35,7.85 59.35,5.7 60.41,4.64 CH1.3
NRF_CE  (via drill 0.5 pad 0.25)  (1 unrouted)
  Top 0.305: v42.96,17.7 42.61,17.7 42.26,18.05 STM32F103RET6.9
  Bottom 0.305: 49.76,16.27 49.38,16.65 49.38,18.07 48.91,18.48 48.28,18.48 47.84,18.07 43.51,18.07 43.13,17.7 v42.96,17.7
NRF_CSN  (via drill 0.5 pad 0.25)  (1 unrouted)
  Top 0.305: v42.96,18.73 42.81,18.73 42.63,18.55 STM32F103RET6.10
  Bottom 0.305: 49.96,18.32 49.19,19 48.16,19 47.59,18.55 43.21,18.55 v42.96,18.73
NRF_IRQ  (via drill 0.5)  (1 unrouted)
  Top 0.305: v36.26,24.8 36.03,24.45 STM32F103RET6.24
  Bottom 0.305: 50.03,26.45 47.91,24.32 45.48,24.32 44.51,23.35 44.01,23.35 43.16,24.2 41.23,24.2 40.96,24.5 40.46,24.5 40.03,24.93 39.34,24.93 38.71,25.55 36.53,25.55 36.26,25.25 v36.26,24.8
NSRST  (via drill 0.5 pad 0.25)
  Top 0.305: STM32F103RET6.7 40.59,17.05 39.34,15.8 37.66,15.8 v37.16,15.3 | RESET.1 RESET.2 36.98,1.62 36.96,1.62 36.9,1.69 | v34.78,9.88 33.69,9.88 32.23,8.43 32.23,6.83 | 32.23,6.83 32.21,6.8 31.43,6.8 30.96,6.33 30.96,2.25 31.56,1.65 32.28,1.65 C5.1 32.09,1.62 31.96,1.75 32.16,1.75 32.31,1.6 32.31,0.8 32.56,0.55 36.48,0.55 36.91,0.97 36.9,1.69 | 36.9,1.69 36.96,1.75 | R9.2 32.26,6.85 32.23,6.83
  Bottom 0.305: v34.78,9.88 35.48,10.53 35.51,13.62 v37.16,15.3
SPI1_MISO  (via drill 0.5)  (1 unrouted)
  Top 0.305: v36.19,20.6 36.66,20.6 37.03,20.98 STM32F103RET6.22
  Bottom 0.305: 49.09,22.4 48.11,23.38 45.88,23.38 44.91,22.4 43.63,22.4 42.76,23.25 40.86,23.25 40.53,23.55 39.09,23.55 36.96,21.43 | v36.19,20.6 36.64,21.06 36.91,21.32 36.96,21.38 36.96,21.43 | 36.96,21.43 37.01,21.43 37.03,21.45
SPI1_MOSI  (via drill 0.5)  (1 unrouted)
  Top 0.305: v36.19,21.77 36.19,22.25 36.53,22.6 STM32F103RET6.23
  Bottom 0.305: 49.84,20.38 49.61,20.65 49.61,21.15 48.86,21.9 47.91,22.9 46.09,22.9 45.09,21.9 43.44,21.9 42.56,22.77 40.66,22.77 40.36,23.07 39.28,23.07 37.44,21.23 37.44,20.79 36.5,19.85 35.85,19.85 35.45,20.25 35.45,21.04 v36.19,21.77
SPI1_SCK  (via drill 0.5)  (1 unrouted)
  Top 0.305: v37.28,24.8 37.28,24.62 37.53,24.25 STM32F103RET6.21
  Bottom 0.305: 48.71,24.43 48.13,23.85 45.69,23.85 44.71,22.88 43.81,22.88 42.96,23.73 41.03,23.73 40.73,24.02 40.26,24.02 39.84,24.45 39.13,24.45 38.51,25.07 37.56,25.07 v37.28,24.8
SPI2_MISO  (via drill 0.5)  (1 unrouted)
  Top 0.305: 26.23,11 26.51,11.28 27.11,11.28 27.43,11.62 27.43,14 27.71,14.4 27.71,19.5 27.91,19.7 27.91,20.32 28.14,20.55 STM32F103RET6.35 | v21.26,11.45 21.26,11.72 21.46,12.03 21.46,13.78 20.64,14.6 v20.64,15.35
  Bottom 0.305: U$3.10 21.14,16.4 20.64,15.9 v20.64,15.35 | v24.36,11.15 21.51,11.15 v21.26,11.45
SPI2_MOSI  (1 unrouted)
  Top 0.305: 26.21,7.42 26.21,8.18 26.41,8.38 27.06,8.38 27.48,9 27.48,11 27.91,11.45 27.91,13.78 28.18,14.22 28.18,19.27 28.21,19.3 28.39,19.5 28.39,19.88 28.56,20.05 STM32F103RET6.36
SPI2_SCK  (via drill 0.5)  (1 unrouted)
  Top 0.305: 26.23,13.88 26.46,14.1 26.91,14.1 27.23,14.55 27.23,19.68 27.43,19.88 27.43,20.6 27.89,21.05 STM32F103RET6.34 30.11,21.05 | 22.93,12.7 22.76,12.53 v22.76,12.25
  Bottom 0.305: v22.76,12.25 22.79,12.25 23.06,11.97 25.06,11.97 25.48,12.4 U$3.12
SWCLK  (via drill 0.5)  (2 unrouted)
  Top 0.305: D2.C 21.86,15.6 21.16,16.3 20.26,16.3 19.64,15.68 19.64,15.3 19.43,15.1 | STM32F103RET6.49 31.61,12.1 31.34,12.38 31.34,12.68 v31.21,12.8
  Bottom 0.305: v31.21,12.8 28.59,12.8 28.04,13.38 22.64,13.38 22.14,12.88 16.04,12.88 15.66,13.25 15.66,14.72 v16.04,15.1
SWDIO  (via drill 0.5)  (2 unrouted)
  Top 0.305: D1.C 22.61,17.05 22.43,16.88 21.66,16.88 21.29,17.25 20.23,17.25 20.09,17.1 | STM32F103RET6.46 31.34,15.05 31.71,15.43 v31.71,15.78 | v17.66,18.2 17.48,18.2 17.23,17.95 17.23,17.57 17.68,17.12
  Bottom 0.305: v31.71,15.78 31.71,16.62 31.34,17 28.73,17 28.36,17.38 19.16,17.38 18.29,18.25 17.71,18.25 v17.66,18.2
TEMP_S  (1 unrouted)
  Top 0.305: 38.69,26.07 38.71,26.05 38.71,25.25 38.03,24.57 STM32F103RET6.20
TIM3_CH1  (via drill 0.5)  (1 unrouted)
  Top 0.305: 12.21,21.55 12.59,21.18 13.56,21.18 | 13.56,21.18 13.59,21.15 | STM32F103RET6.55 35.03,13.95 v34.71,14.28 | v15.94,17.95 14.54,17.95 | 14.54,17.95 14.51,17.98 | 14.54,17.95 C11.2 14.46,17.98 14.46,19.25 13.56,20.15 R23.2 13.56,21.18
  Bottom 0.305: v34.71,14.28 34.69,14.28 33.94,15.03 28.48,15.03 28.11,15.4 22.16,15.4 21.23,14.47 18.11,14.47 17.14,15.45 17.14,16.75 v15.94,17.95
TIM8_CH1  (via drill 0.5)  (2 unrouted)
  Top 0.305: C21.2 17.14,24.2 17.64,24.7 19.01,24.7 19.31,25 | 19.31,28.1 v19.81,28.6 | v29.18,22.93 29.86,22.93 31.26,21.62 31.26,19.77 31.09,19.55 STM32F103RET6.37
  Bottom 0.305: v19.81,28.6 23.91,28.6 | 23.91,28.6 23.93,28.62 | 23.91,28.6 23.91,27.52 23.04,26.65 23.04,25.43 23.51,24.95 23.51,23.65 24.14,22.93 v29.18,22.93 | R22.2 23.91,28.6
USART1_RX  (via drill 0.5)
  Top 0.305: STM32F103RET6.43 31.98,16.55 v32.41,16.98 | R17.2 2.94,19.45 3.81,18.57 6.43,18.57 | 6.43,18.57 6.46,18.6 v8.73,18.6 | 6.43,18.57 2N2222.C
  Bottom 0.305: v32.41,16.98 31.91,17.5 29.11,17.5 28.64,17.98 28.64,19.25 28.36,19.55 9.29,19.55 8.88,19.15 8.88,18.73 v8.73,18.6
USART3_RX  (via drill 0.5)  (1 unrouted)
  Top 0.305: STM32F103RET6.52 v33.53,10.85 | v13.61,11.62 9.71,11.62 8.66,12.68 8.31,12.68 8.06,12.93 8.06,13.95 7.68,14.32 7.46,14.32 7.06,14.72 7.06,15.32 6.66,15.72 5.54,15.72 5.06,15.25
  Bottom 0.305: v33.53,10.85 33.51,10.85 33.28,10.68 31.81,10.68 31.56,10.93 29.16,10.93 28.39,10.18 28.39,9.47 28.31,9.4 22.41,9.4 22.29,9.53 15.71,9.53 v13.61,11.62
USART3_TX  (via drill 0.5)
  Top 0.305: STM32F103RET6.51 33.03,11.4 32.56,10.93 32.56,10 v32.46,9.9 | v15.91,7.65 15.46,7.65 14.98,8.12 13.76,8.12 11.36,10.53 R31.2
  Bottom 0.305: v32.46,9.9 30.76,9.9 29.14,8.28 29.14,5.67 28.86,5.42 17.98,5.42 17.51,5.72 17.46,5.78 17.46,6.92 16.73,7.65 v15.91,7.65
V+
  Top 0.813: CH0.2 CH1.2 CH2.2 CH3.2 CH4.2 CH5.2 CH6.2 CH7.2 CH8.2 CH9.2 CH10.2 CH11.2
  Bottom 0.305: 64.64,1.93 64.66,1.95
  Bottom 0.406: 64.64,1.93 63.56,0.6 60.53,0.6 60.4,0.8 60.4,1.4 60,1.8 C7.1 58.78,1.5 BAT60JFILM.A | 64.66,1.95 CH0.2
VBAT_S  (via drill 0.5)
  Top 0.305: 44.96,28.55 44.91,28.5 44.91,28.18 R29.1 | v35.23,24.77 35.23,24.48 35.03,24.27 STM32F103RET6.26 35.03,23.48 | R29.1 44.69,28.5 43.8,28.5 v43.31,28 | R30.1 45.09,29.75 R29.1
  Bottom 0.305: v43.31,28 40,28 39.25,28.9 37.21,28.9 36.76,28.45 36.76,26.6 35.23,25.07 v35.23,24.77
VCC  (via drill 0.5, 0.5 pad 0.25)  (27 unrouted)
  Top 0.305: v23.89,26.18 23.84,26.18 23.86,26.2 | 29.43,25.2 27.48,23.27 R11.2 | 21.31,24.62 20.64,23.95 C20.1 20.64,22.95 | 14.21,24.7 13.56,24.05 R23.1 13.59,23.02 | R20.2 16.23,13.85 | 53.19,0.68 53.19,3.08 53.63,3.58 R18.1 54.94,4.75 55.16,4.97 55.61,4.97 v55.88,5.25 | STM32F103RET6.19 38.53,24.4 40.44,26.2 41.56,26.2 41.71,26.35 41.71,26.32 C18.1 41.69,31.14 | C14.1 v42.61,8.4 41.96,8.4 41.53,8.82 C4.2 40.26,10.05 39.53,10.78 STM32F103RET6.64 39.53,13.53 40.03,14.05 STM32F103RET6.1 42.76,14.05 v42.78,14.07 | R9.1 v34.21,8.28 | STM32F103RET6.48 29.61,14.05 29.61,13.65 29.96,13.03 29.96,12.47 31.31,11.12 31.31,8.35 30.91,7.95 29.98,7.95 C12.1 29.91,6.33 v29.96,6.3 | 16.23,13.85 16.43,14.05 17.64,14.05 | 17.64,14.05 17.71,14.12 | 16.23,13.85 16.06,14.03 15.44,14.03 15.16,13.78 9.86,13.78 9.56,14.07 9.54,14.07 | 21.29,26.23 21.34,26.18 | 1.33,19.4 1.39,19.4 | v9.23,13.78 9.51,14.05 | 17.64,14.05 17.64,14.07 | v35.7,30.75 35.69,30.59 34.95,29.85 34.95,28.1 35.69,27.36 | 10.25,27.5 10.25,23.16 C10.1 | 2.95,23.09 R17.1 | v27.35,30.35 27,29.95 27,29.35 | STM32F103RET6.32 32.05,23.52 32.05,24.25 31.95,24.35 31.4,24.35 31.2,24.55 31.2,25.98 | 30.46,26.73 31.2,25.98 | 31.2,25.98 31.2,26 30.45,26.75 29.45,26.75
  Top 0.406: 21.34,26.18 23.84,26.18 | 23.86,26.2 24.71,26.2 25.45,26.94 25.45,28.2 26.6,29.35 27,29.35 28.3,29.35 29.43,28.21 | 1.33,19.4 1.33,22.48 1.89,23.05 1.91,23.07 R17.1 | v46.9,1.48 47.59,0.6 53.03,0.6 53.19,0.68 53.26,0.6 68.56,0.6 69.08,1.2 69.08,21.25 | 69.08,21.25 69.08,31.25 68.78,31.55 42.1,31.55 v41.75,31.3 41.69,31.14 | 1.39,19.4 3.36,17.48 9.13,17.48 9.54,17.02 9.54,14.07 v9.23,13.78 | 21.29,26.23 21.29,29.02 20.75,29.55 19.15,29.55 18.45,28.85 16.9,28.85 16.7,28.65 16.7,27.6 15.8,26.7 14.23,26.7 | 14.19,26.2 14.19,27.96 13.8,28.35 11.1,28.35 10.25,27.5 9.45,28.35 6.4,28.35 6.08,27.98 | 6.08,27.91 5.7,28.3 3.5,28.3 2.95,27.75 2.95,23.09 | 29.45,26.75 29.45,29.05 29.6,29.2 31.35,29.2 32.15,30 v32.15,30.85 | v68.4,21.15 68.98,21.15 69.08,21.25
  Bottom 0.305: R22.1 25.84,28.12 v23.89,26.18 | v46.9,1.48 47.01,2.62 45.7,3.94 | 45.7,3.94 IC1.4 43.03,6.6 | IC1.2 51.71,4.28 51.78,4.2 45.96,4.2 45.7,3.94 | v42.61,8.4 42.59,7.75 | v42.78,14.07 42.78,14.78 43.26,15.25 FCM1608-0603.1 | v55.88,5.25 55.88,5.45 56.31,5.88 56.56,5.88 56.76,6.08 56.76,6.75 | 56.76,6.75 56.76,7.05 56.73,7.08 59.06,7.08 C13.1 | v34.21,8.28 34.21,6.45 32.51,4.75 | 11.04,12.38 10.96,12.3 10.96,12.32 U$3.5 | C15.1 56.78,6.78 56.76,6.75 | 54.91,17.7 | 41.6,31.31 v41.75,31.3 | v35.7,30.75 35.7,31.55 | C17.1 28.34,30.35 v27.35,30.35
  Bottom 0.406: 10.96,12.3 9.66,12.3 9.31,12.65 9.31,13.3 9.29,13.3 9.11,13.47 9.11,13.65 v9.23,13.78 | 41.6,31.31 41.31,31.55 35.7,31.55 32.5,31.55 32.15,31.2 v32.15,30.85 | 55.57,17.72 56.85,19 58.25,19 60.4,21.15 v68.4,21.15 | C6.1 54.91,14.53 54.91,17.7 54.92,17.71
  pour Bottom (isolate 0.305): 29.11,7.62 29.11,0.53 50.19,0.53 50.19,9.57 32.28,9.57 32.28,7.62
VDD  (via drill 0.5)  (1 unrouted)
  Top 0.406: v8.13,11.82 7.33,11.82 7.06,12.1 7.06,13.1 7.01,13.15
  Bottom 0.38: 14.26,7.4 9.76,7.4
  Bottom 0.406: BAT60JFILM.C 52.12,1.5 IC1.3 51.63,0.93 51.11,0.6 15.51,0.6 15.09,1.07 15.09,6.7 14.26,7.4 | 9.76,7.4 8.98,8 8.98,10.97 v8.13,11.82

### Text on the board
bPlace: AriloRX | (c) J.ARIGITA